# EAGLE design cell phone detector (EAGLE 9.5.2)
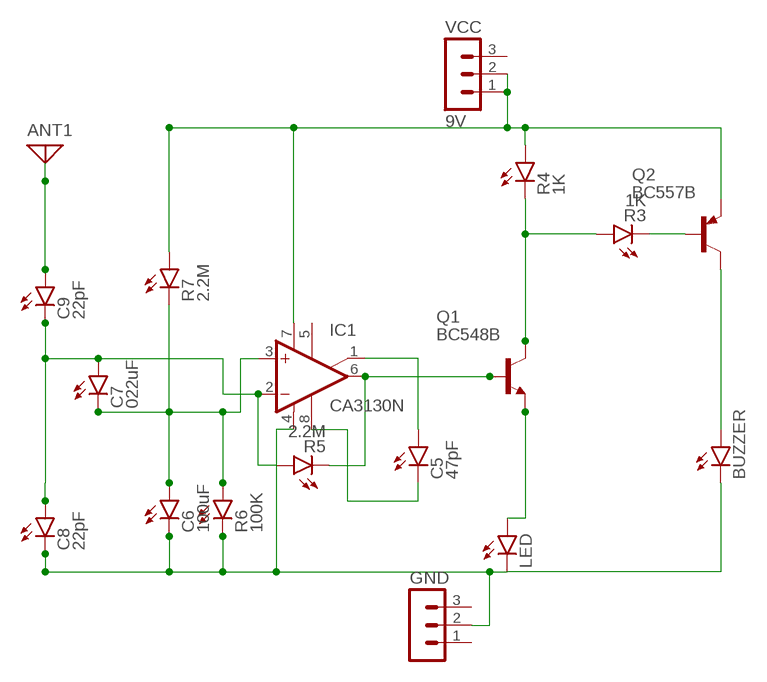
[diagram p0: schematic, sheet 1]

## Parts
ANT1  ANTENNA  [PAD-01]
BUZZER  LED5MM  [LED5MM]
C5  47pF  LED5MM  [LED5MM]
C6  100uF  LED5MM  [LED5MM]
C7  022uF  LED5MM  [LED5MM]
C8  22pF  LED5MM  [LED5MM]
C9  22pF  LED5MM  [LED5MM]
GND  MA03-1  [MA03-1]
IC1  CA3130N  [DIL08]
LED  LED5MM  [LED5MM]
Q1  BC548B  [TO92-EBC]
Q2  BC557B  [TO92-EBC]
R3  1K  LED5MM  [LED5MM]
R4  1K  LED5MM  [LED5MM]
R5  2.2M  LED5MM  [LED5MM]
R6  100K  LED5MM  [LED5MM]
R7  2.2M  LED5MM  [LED5MM]
VCC  9V  MA03-1  [MA03-1]

## Nets
N$1: Q2.B R3.K(C)
N$2: ANT1.1 C9.A
N$3: IC1.7(V+) Q2.E R4.A R7.A VCC.1 VCC.2
N$4: LED.A Q1.E
N$5: Q1.C R3.A R4.K(C)
N$6: C6.A C7.K(C) IC1.3(+IN) R6.A R7.K(C)
N$7: IC1.6(OUT) Q1.B R5.K(C)
N$8: BUZZER.A Q2.C
N$9: C7.A C8.A C9.K(C) IC1.2(-IN) R5.A
N$10: BUZZER.K(C) C6.K(C) C8.K(C) GND.2 IC1.4(V-) LED.K(C) R6.K(C)
N$11: C5.A IC1.1(ON/CMP)
N$12: C5.K(C) IC1.8(CMP)
Unconnected: GND.1 GND.3 IC1.5(ON) VCC.3

## Library data of the parts
ANT1 = discrete:ANTENNA: Antenna
BUZZER C5-C9 LED R3-R7 = led:LED: LED OSRAM: - CHIPLED LG R971, LG N971, LY N971, LG Q971, LY Q971, LO R971, LY R971 LH N974, LH R974 LS Q976, LO Q976, LY Q976 LO Q996 - Hyper CHIPLED LW Q18S LB Q993, LB Q99A, LB R99A - SideLED LS A670, LO A670, LY A670, LG A670, LP A670 LB A673, LV A673, LT A673, LW A673 LH A674 LY A675 LS A676, LA A676, LO A676, LY A676, LW A676 LS A679, LY A679, LG A679 - Hyper Micro SIDELED® LS Y876, LA Y876, LO Y876, LY Y876 LT Y87S - SmartLED LW L88C, LW L88S LB L89C, LB L89S, LG L890 LS L89K, LO L89K, LY L89K LS L896, LA L896, LO L896, LY L896 - TOPLED LS T670, LO T670, LY T670, LG T670, LP T670 LSG T670, LSP T670, LSY T670, LOP T670, LYG T670 LG T671, LOG T671, LSG T671 LB T673, LV T673, LT T673, LW T673 LH T674 LS T676, LA T676, LO T676, LY T676, LB T676, LH T676, LSB T676, LW T676 LB T67C, LV T67C, LT T67C, LS T67K, LO T67K, LY T67K, LW E67C LS E67B, LA E67B, LO E67B, LY E67B, LB E67C, LV E67C, LT E67C LW T67C LS T679, LY T679, LG T679 LS T770, LO T770, LY T770, LG T770, LP T770 LB T773, LV T773, LT T773, LW T773 LH T774 LS E675, LA E675, LY E675, LS T675 LS T776, LA T776, LO T776, LY T776, LB T776 LHGB T686 LT T68C, LB T68C - Hyper Mini TOPLED® LB M676 - Mini TOPLED Santana® LG M470 LS M47K, LO M47K, LY M47K Source: http://www.osram.convergy.de LUXEON: - LUMILED® LXK2-PW12-R00, LXK2-PW12-S00, LXK2-PW14-U00, LXK2-PW14-V00 LXK2-PM12-R00, LXK2-PM12-S00, LXK2-PM14-U00 LXK2-PE12-Q00, LXK2-PE12-R00, LXK2-PE12-S00, LXK2-PE14-T00, LXK2-PE14-U00 LXK2-PB12-K00, LXK2-PB12-L00, LXK2-PB12-M00, LXK2-PB14-N00, LXK2-PB14-P00, LXK2-PB14-Q00 LXK2-PR12-L00, LXK2-PR12-M00, LXK2-PR14-Q00, LXK2-PR14-R00 LXK2-PD12-Q00, LXK2-PD12-R00, LXK2-PD12-S00 LXK2-PH12-R00, LXK2-PH12-S00 LXK2-PL12-P00, LXK2-PL12-Q00, LXK2-PL12-R00 Source: www.luxeon.com KINGBRIGHT: KA-3528ASYC Source: www.kingbright.com
GND VCC = con-lstb:MA03-1: PIN HEADER; OC_FARNELL: unknown; OC_NEWARK: unknown
IC1 = linear:CA3130: OP AMP
Q1 = transistor-npn:BC548*: NPN Transistor
Q2 = transistor-pnp:BC557*: PNP Transistror

## Net classes
0 default: width 0.305 mm, drill 0.508 mm, clearance 0.254 mm

## Board
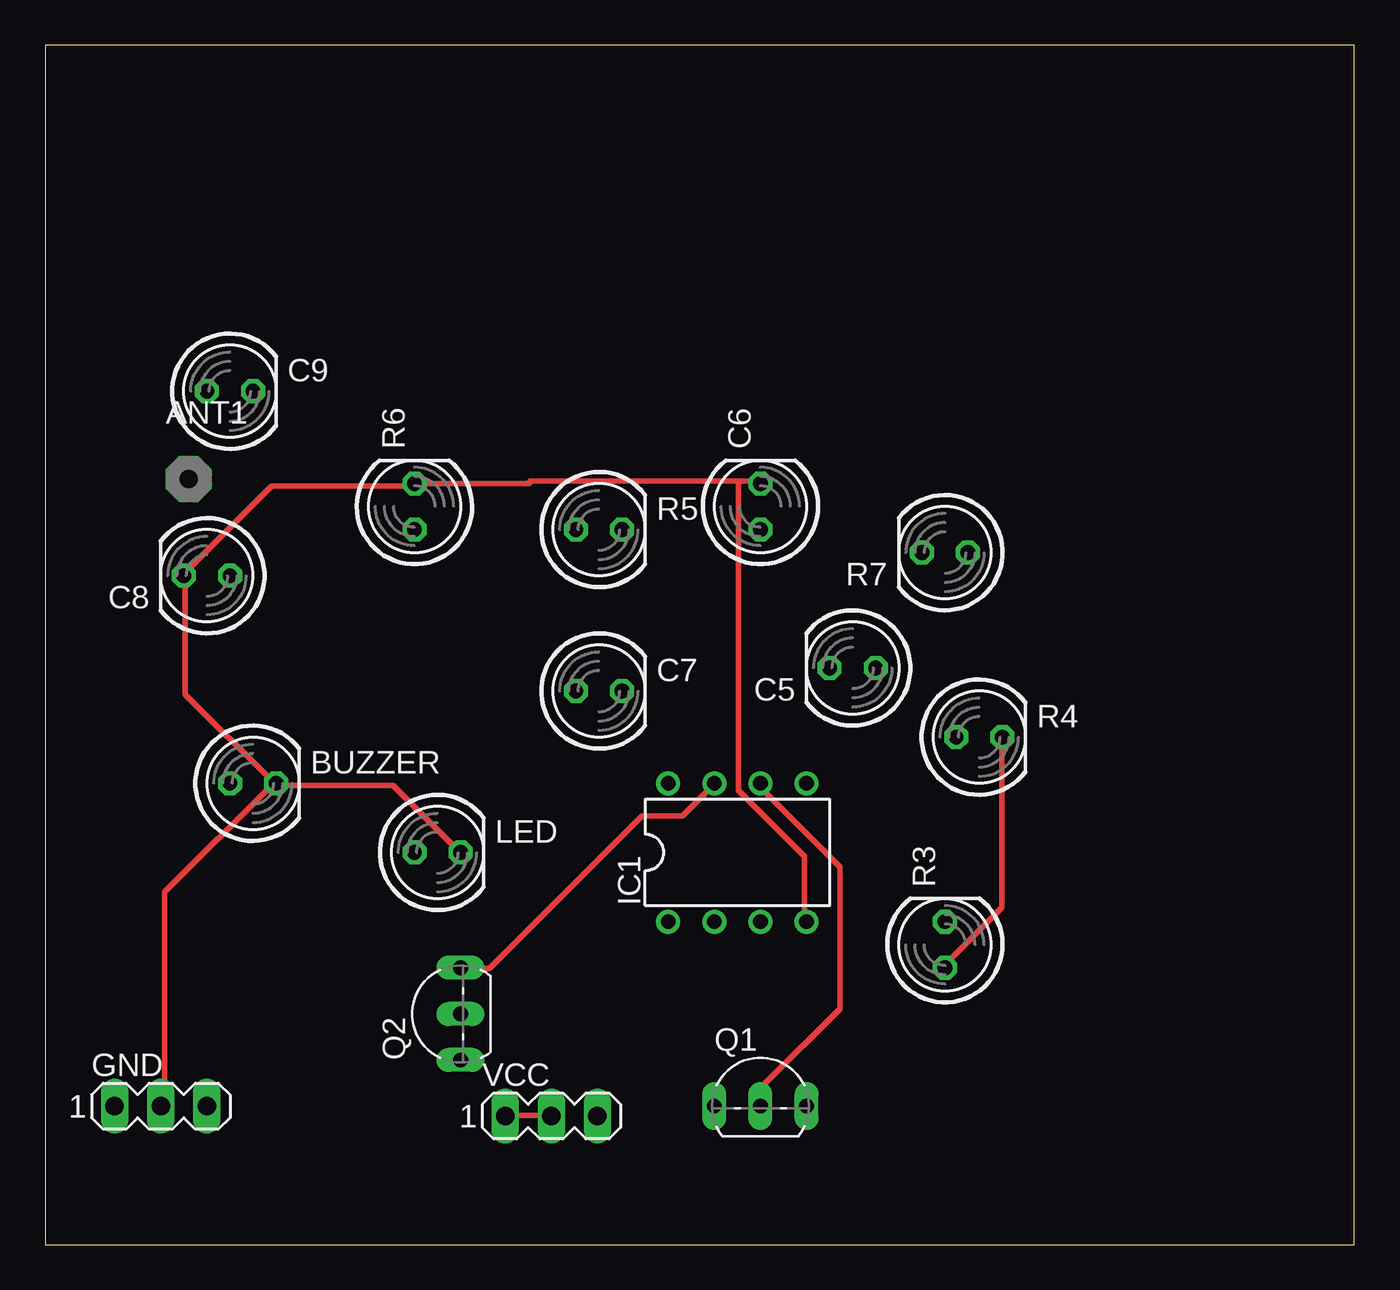
[diagram p1: board, top side]
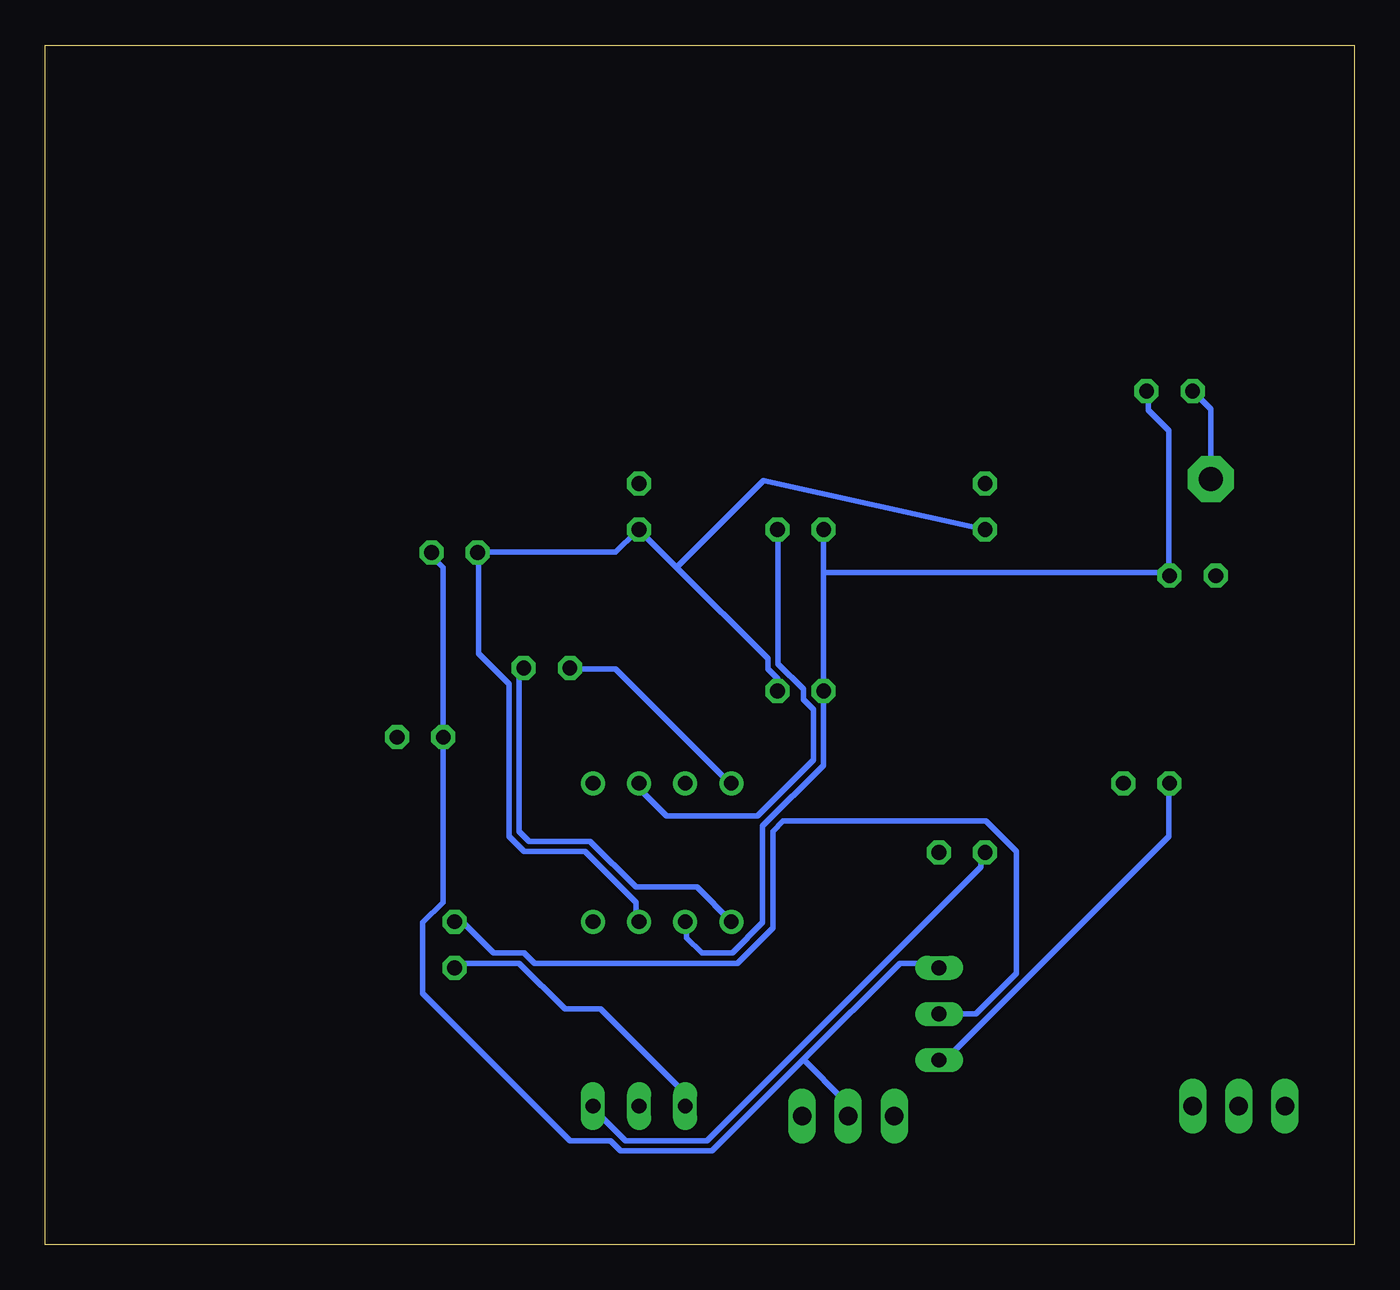
[diagram p2: board, bottom side, seen from below]

Size 72.06 x 66.03 mm. Coordinates in mm from the lower left corner, seen from the top.
Outline: 0,0 72.06,0 72.06,66.03 0,66.03 0,0
Copper layers (1*16): Top 0.035mm / dielectric 1.5mm / Bottom 0.035mm
Design rules "default": minimum track width 6mil, minimum drill 0.35mm, track to track 6mil, track to pad 6mil, pad to pad 6mil, via to via 6mil, smd to smd 6mil, copper to edge 40mil, drill to drill 6mil, minimum pad ring 10mil, minimum via ring 8mil, stop-mask expansion 4mil, vias tented up to drill 0mil, thermal gap 10mil

### Footprints (pad centres in the part's own frame; a part is rotated, then mirrored left to right if it is on the bottom)
PAD-01 = drill 1.321 pad 2.54 octagon: 1 0,0
LED5MM = drill 0.813 octagon: A -1.27,0; K 1.27,0
MA03-1 = drill 1.016 long: 1 -2.54,0; 2 0,0; 3 2.54,0
DIL08 = drill 0.813 pad 1.27: 1 -3.81,-3.81; 2 -1.27,-3.81; 3 1.27,-3.81; 4 3.81,-3.81; 5 3.81,3.81; 6 1.27,3.81; 7 -1.27,3.81; 8 -3.81,3.81
TO92-EBC = drill 0.813 long: B 0,-1.27; C -2.54,-1.27; E 2.54,-1.27

### Placement (x,y rotation side)
ANT1  7.89,42.15 0 top
BUZZER  11.43,25.4 0 top
C5  44.45,31.75 180 top
C6  39.37,40.64 90 top
C7  30.48,30.48 0 top
C8  8.89,36.83 180 top
C9  10.16,46.99 0 top
GND  6.35,7.62 0 top
IC1  38.1,21.59 0 top
LED  21.59,21.59 0 top
Q1  39.37,8.89 0 top
Q2  21.59,12.7 90 top
R3  49.53,16.51 90 top
R4  51.42,27.94 0 top
R5  30.48,39.37 0 top
R6  20.32,40.64 90 top
R7  49.53,38.1 180 top
VCC  27.86,7.08 0 top

### Tracks (layer width: path | path; a pad name or v marks a point on that pad's centre or on a via)
N$1
  Bottom 0.305: Q2.B 20.83,12.7 18.59,14.93 18.59,21.64 20.27,23.32 31.45,23.32 32,22.76 32,17.45 33.96,15.49 45.14,15.49 45.7,16.05 47.37,16.05 49.33,18.01 R3.K
N$2
  Bottom 0.305: C9.A 7.89,45.99 ANT1.1
N$3
  Top 0.305: Q2.E 23.06,15.21 24.46,15.21 32.84,23.6 35.08,23.6 36.47,24.99 36.47,25.27 36.75,25.55 IC1.7 | VCC.1 25.58,7.11 27.81,7.11 VCC.2
  Bottom 0.305: 51,37.85 R7.A 50.72,37.85 50.17,37.29 50.17,29.74 50.15,29.74 R4.A 50.17,27.79 50.17,18.85 51.28,17.73 51.28,13.82 43.18,5.71 40.95,5.71 40.39,5.16 35.36,5.16 30.33,10.19 | 30.33,10.19 25.02,15.49 23.06,15.49 Q2.E | 30.33,10.19 28.09,7.95 28.09,7.11 VCC.2
N$4
  Bottom 0.305: Q1.E 41.78,7.39 40.11,5.71 35.64,5.71 20.55,20.8 20.55,21.36 LED.A
N$5
  Top 0.305: R4.K 52.68,27.79 52.68,18.57 49.61,15.49 R3.A
  Bottom 0.305: Q1.C 37.03,7.67 37.03,8.51 41.5,12.98 43.46,12.98 45.97,15.49 49.33,15.49 R3.A 49.61,15.21
N$6
  Bottom 0.305: IC1.3 39.55,18.01 39.55,18.85 42.34,21.64 45.7,21.64 46.53,22.48 46.53,30.86 48.21,32.54 48.21,37.85 R7.K 48.21,38.12 40.67,38.12 39.55,39.24 C6.A 39.27,39.24 37.31,37.29 | 37.31,37.29 32.28,32.26 32.28,31.7 31.72,31.14 31.72,30.58 C7.K | 37.31,37.29 32.52,42.08 R6.A
N$7
  Top 0.305: Q1.B 39.55,7.67 39.55,8.79 43.74,12.98 43.74,20.8 39.27,25.27 IC1.6
  Bottom 0.305: R5.K 31.72,39.24 31.72,31.98 30.33,30.58 30.33,30.02 29.77,29.46 29.77,26.67 32.84,23.6 37.87,23.6 39.55,25.27 IC1.6
N$8
  Bottom 0.305: BUZZER.A 10.21,25.27 10.21,22.48 22.78,9.91 Q2.C
N$9
  Bottom 0.305: 10.21,37.01 10.21,44.83 11.33,45.95 11.33,46.79 C9.K | IC1.2 36.75,17.73 36.75,16.89 35.92,16.05 34.24,16.05 32.56,17.73 32.56,23.04 29.21,26.39 C7.A 29.21,37.01 | 29.21,37.01 R5.A | 29.21,37.01 10.21,37.01 | 10.21,37.01 C8.A
N$10
  Top 0.305: BUZZER.K 12.73,25.27 19.15,25.27 22.78,21.64 LED.K | BUZZER.K 12.45,25.55 7.7,30.3 7.7,36.73 C8.K 7.7,37.01 12.45,41.76 20.27,41.76 R6.K 26.65,41.91 26.7,42.04 38.15,42.04 | 38.15,42.04 39.27,42.04 C6.K | 38.15,42.04 38.15,24.99 41.78,21.36 41.78,18.01 IC1.4 | GND.2 6.58,7.67 6.58,19.41 12.45,25.27 BUZZER.K
N$11
  Bottom 0.305: IC1.1 36.2,19.68 39.55,19.68 42.06,22.2 45.42,22.2 45.97,22.76 45.97,31.7 C5.A
N$12
  Bottom 0.305: IC1.8 34.52,25.55 40.67,31.7 43.18,31.7 C5.K